# Altium project 04_02_SR_Latch.PrjPcb
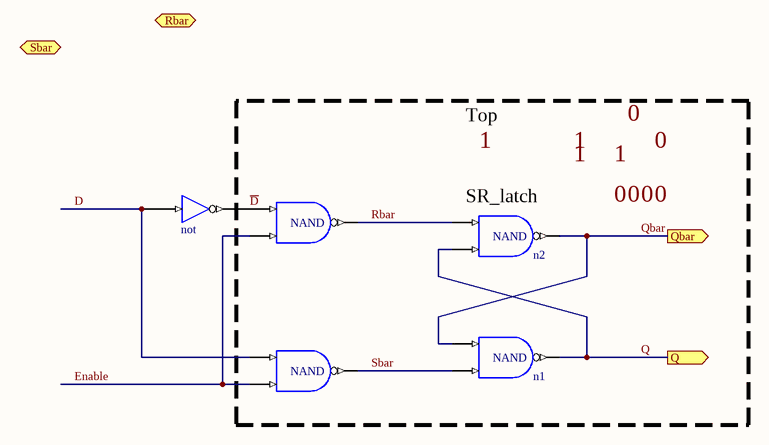
[diagram p0: S_R_Latch.SchDoc]
1 sheet, 5 parts. Net scope: flat (ports and power ports of the same name join across sheets).

## Sheet S_R_Latch.SchDoc
size A

### Parts
(Parts that share a designator on the sheet are numbered #1, #2 ... from top to bottom, then left to right.)
n1  NAND
n2  NAND
U9#1  NAND
U9#2  NAND
U16  not

### Ports
Q (out), Qbar (out), Rbar (in), Sbar (in)

### Nets
D: U9#2.A U16.I
~{D}: U9#1.A U16.O
Enable: U9#1.B U9#2.B
Q: n1.Y n2.B ; port Q
Qbar: n1.A n2.Y ; port Qbar
Rbar: n2.A U9#1.Y
Sbar: n1.B U9#2.Y

### Notes on the sheet
- Top
- (near n2) SR_latch
- Labels drawn without touching a wire or pin: 0, 1

### Library data of the parts
n1 n2 U9#1 U9#2 = AND: 2 Input AND
U16 = BUF: 1-bit General Purpose (Non-inverting) Buffer